# EAGLE design RingCenter_v2 (EAGLE 8.6.0)
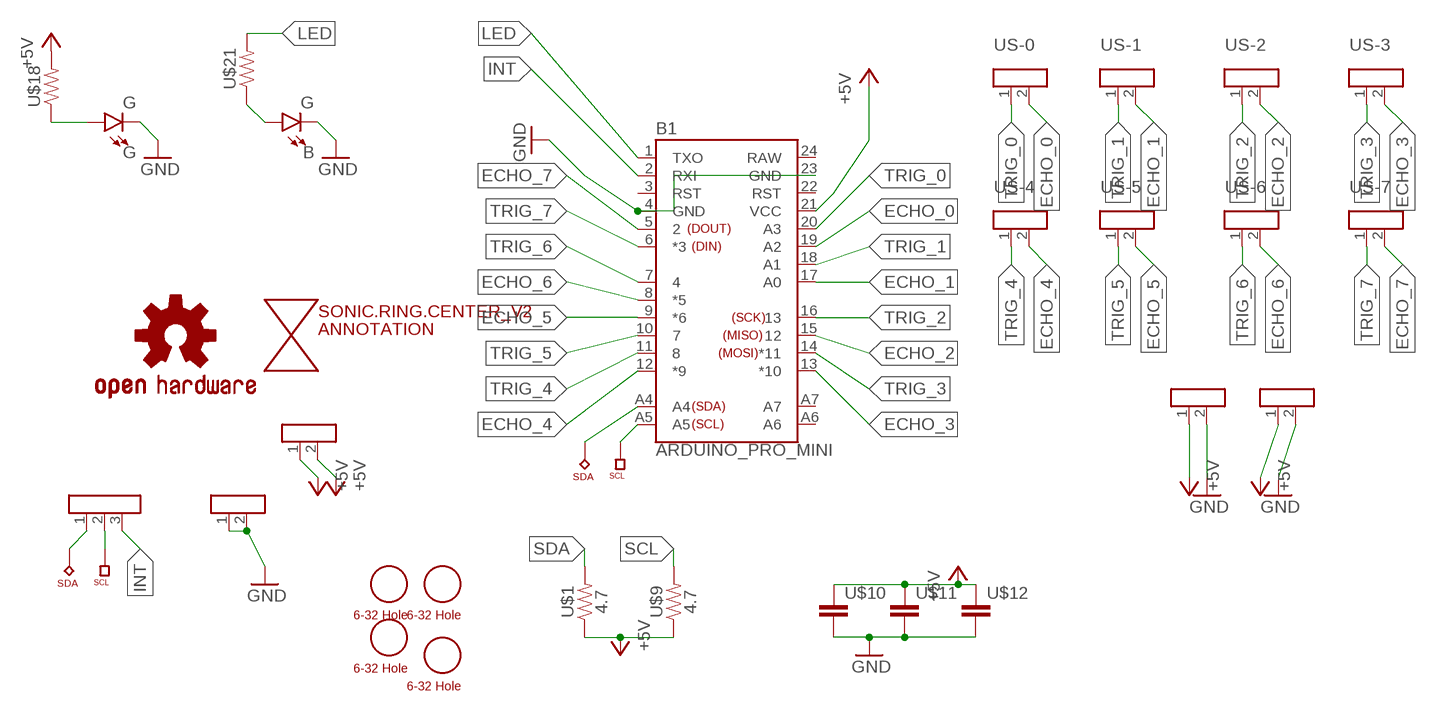
[diagram p0: schematic, sheet 1]

## Parts
B  G  LEDSMD  [LED_SMD]
B1  ARDUINO_PRO_MINI  [ARDUINO_PRO_MINI]
G  G  LEDSMD  [LED_SMD]
LOGO1  OSHW-LOGOM  [OSHW-LOGO-M]
SONIC.RING.CENTER_V2  ANNOTATION  [ANNOTATION]
U$1  4.7  RESISTORSMD  [R1206]
U$2  2XHEADER  [2XHEADER]
U$3  2XHEADER  [2XHEADER]
U$4  2XHEADER  [2XHEADER]
U$5  2XHEADER  [2XHEADER]
U$6  2XHEADER  [2XHEADER]
U$7  2XHEADER  [2XHEADER]
U$8  2XHEADER  [2XHEADER]
U$9  4.7  RESISTORSMD  [R1206]
U$10  CAP_SMCAP  [C1206]
U$11  CAP_SMCAP  [C1206]
U$12  CAP_SMCAP  [C1206]
U$13  632  [632]
U$14  632  [632]
U$15  632  [632]
U$16  632  [632]
U$17  3XHEADER  [3XHEADER]
U$18  RESISTORSMD  [R1206]
U$21  RESISTORSMD  [R1206]
US-0  2XHEADER  [2XHEADER]
US-1  2XHEADER  [2XHEADER]
US-4  2XHEADER  [2XHEADER]
US-5  2XHEADER  [2XHEADER]
US-6  2XHEADER  [2XHEADER]

## Nets
+5V [pow]: B1.21(VCC) U$1.1 U$9.1 U$10.1 U$11.1 U$12.1 U$18.2 US-4.1 US-5.1 US-6.1 US-6.2
ECHO_0: B1.19(A2) US-0.2
ECHO_1: B1.17(A0) U$8.2
ECHO_2: B1.15 U$2.2
ECHO_3: B1.13(*10) U$7.2
ECHO_4: B1.12(*9) U$3.2
ECHO_5: B1.9(*6) U$6.2
ECHO_6: B1.8(*5) U$4.2
ECHO_7: B1.5 U$5.2
GND [pow]: B1.4(GND) B1.23(GND) B.C G.C U$10.2 U$11.2 U$12.2 US-1.1 US-1.2 US-4.2 US-5.2
INT: B1.2(RXI) U$17.3
LED: B1.1(TXO) U$21.2
N$1: G.A U$18.1
N$2: B.A U$21.1
SCL: B1.A5 U$9.2 U$17.2
SDA: B1.A4 U$1.2 U$17.1
TRIG_0: B1.20(A3) US-0.1
TRIG_1: B1.18(A1) U$8.1
TRIG_2: B1.16 U$2.1
TRIG_3: B1.14(*11) U$7.1
TRIG_4: B1.11 U$3.1
TRIG_5: B1.10 U$6.1
TRIG_6: B1.7 U$4.1
TRIG_7: B1.6(*3) U$5.1
Unconnected: B1.3(RST) B1.22(RST) B1.A6 B1.A7

## Notes on the sheet
- US-0 | US-1 | US-2 | US-3
- US-4 | US-5 | US-6 | US-7

## Power pins joined to a net without a drawn wire
RAW: B1.24(RAW)

## Library data of the parts
B G = Richard_Components:LED
B1 = Richard_Micros:ARDUINO_PRO_MINI: SparkFun Pro Mini Pro Mini compatible footprint. Dimensions: 0.7 x 1.3" PCB Thickness: 0.8mm SparkFun Products: 3.3V/8MHz <https://www.sparkfun.com/products/11114> 5V/16MHz <https://www.sparkfun.com/products/11113>
LOGO1 = Richard_Symbols:OSHW-LOGO: Open-Source Hardware (OSHW) Logo This logo indicates the piece of hardware it is found on incorporates a OSHW license and/or adheres to the definition of open source hardware found here: http://freedomdefined.org/OSHW
SONIC.RING.CENTER_V2 = Richard_Symbols:ANNOTATION
U$1 U$9 U$18 U$21 = Richard_Components:RESISTOR
U$2-U$8 US-0 US-1 US-4-US-6 = Richard_Headers:2XHEADER
U$10-U$12 = Richard_Components:CAP_SM
U$13-U$16 = Richard_Holes:632
U$17 = Richard_Headers:3XHEADER

## Net classes
0 default: width 0.254 mm
1 pow: width 0.381 mm

## Board
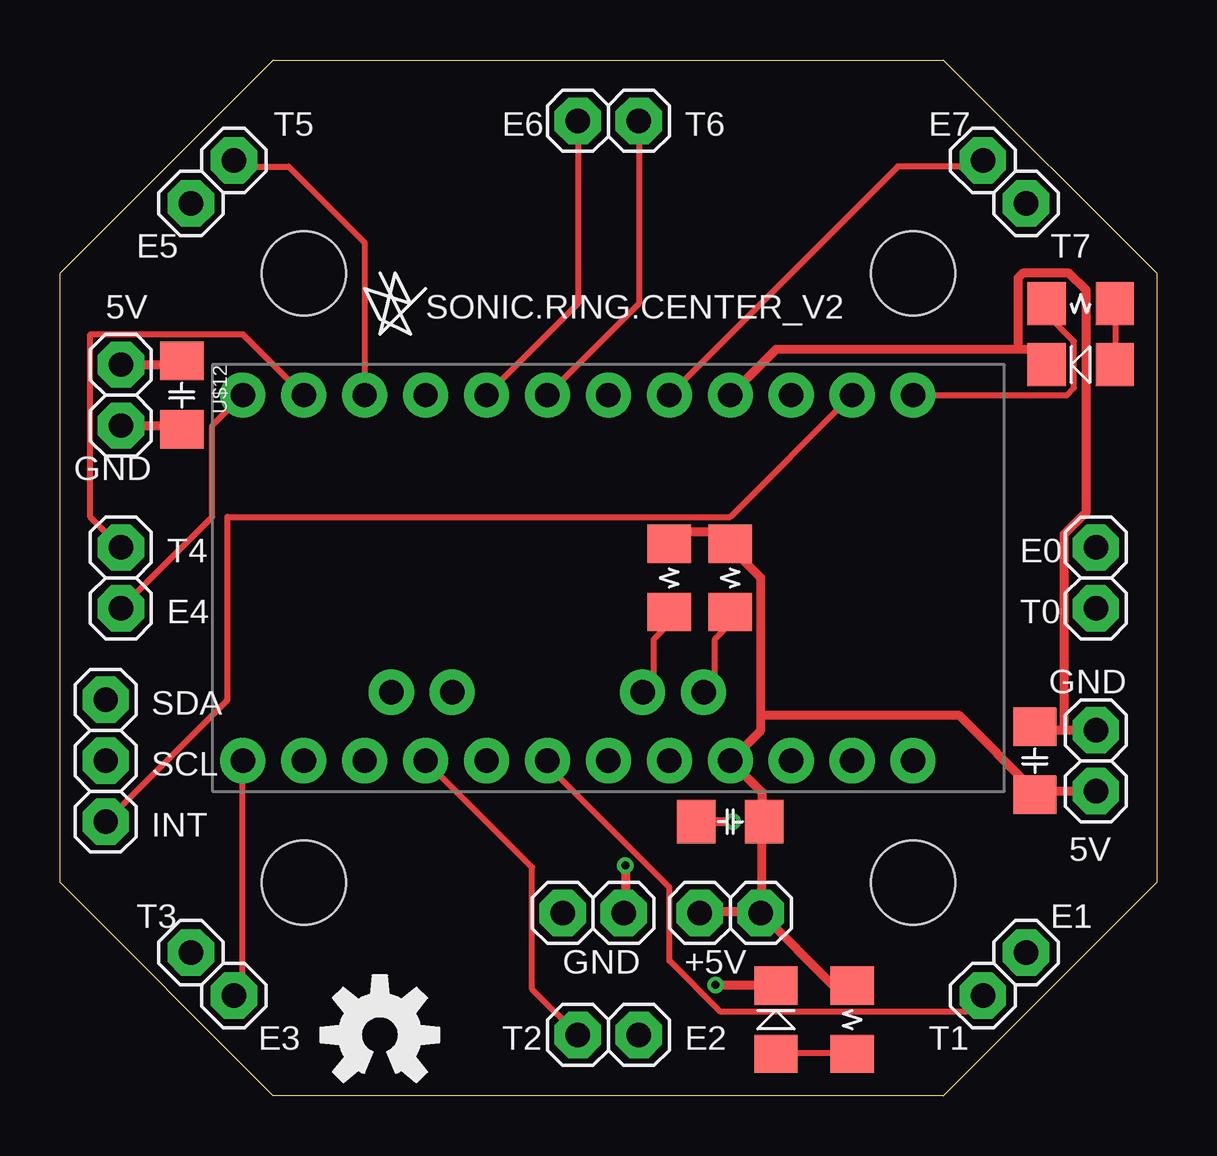
[diagram p1: board, top side]
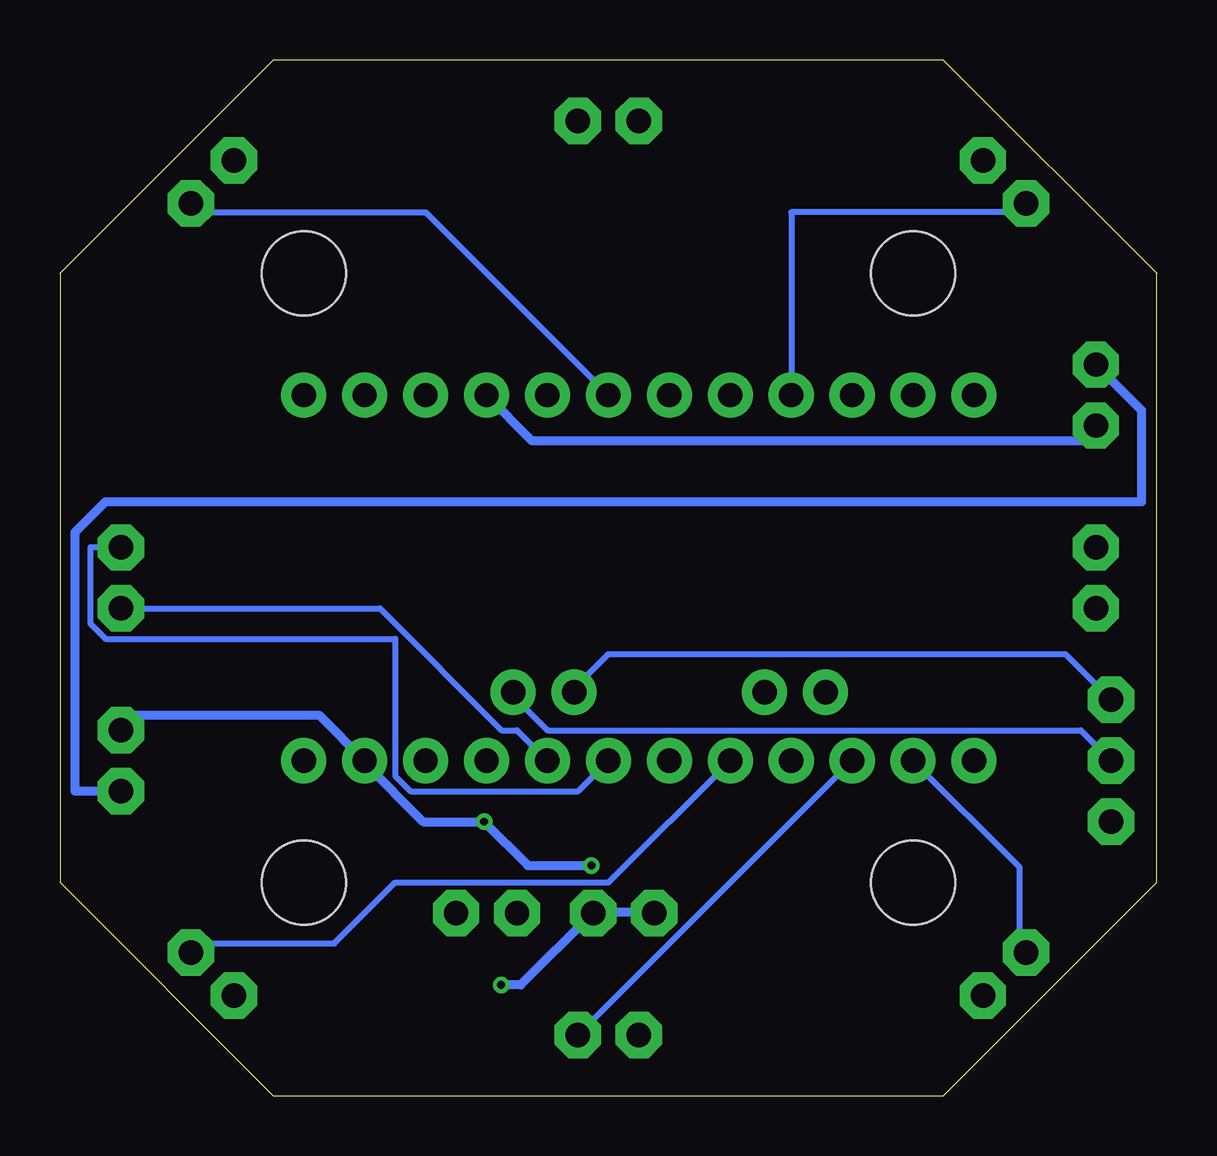
[diagram p2: board, bottom side, seen from below]

Size 45.72 x 43.18 mm. Coordinates in mm from the lower left corner, seen from the top.
Outline: 8.89,43.18 36.83,43.18 45.72,34.29 45.72,8.89 36.83,0 8.89,0 0,8.89 0,34.29 8.89,43.18
Copper layers (1*16): Top 0.0356mm / dielectric 1.5011mm / Bottom 0.0356mm
Design rules "LaenPCBOrder": minimum track width 6mil, minimum drill 13mil, track to track 6mil, track to pad 6mil, pad to pad 6mil, via to via 6mil, smd to smd 6mil, copper to edge 15mil, drill to drill 6mil, minimum pad ring 7mil, minimum via ring 7mil, stop-mask expansion 3mil, vias tented up to drill 0mil, thermal gap 10mil

### Footprints (pad centres in the part's own frame; a part is rotated, then mirrored left to right if it is on the bottom)
LED_SMD = smd 1.6 x 1.803: A -1.422,0; C 1.422,0
ARDUINO_PRO_MINI = drill 1.016 pad 1.88: 1 -7.62,12.7; 2 -7.62,10.16; 3 -7.62,7.62; 4 -7.62,5.08; 5 -7.62,2.54; 6 -7.62,0; 7 -7.62,-2.54; 8 -7.62,-5.08; 9 -7.62,-7.62; 10 -7.62,-10.16; 11 -7.62,-12.7; 12 -7.62,-15.24; 13 7.62,-15.24; 14 7.62,-12.7; 15 7.62,-10.16; 16 7.62,-7.62; 17 7.62,-5.08; 18 7.62,-2.54; 19 7.62,0; 20 7.62,2.54; 21 7.62,5.08; 22 7.62,7.62; 23 7.62,10.16; 24 7.62,12.7; A4 4.763,1.429; A5 4.763,3.969; A6 4.763,-9.049; A7 4.763,-6.509
R1206 = smd 1.6 x 1.803: 1 -1.422,0; 2 1.422,0
2XHEADER = drill 1.016 pad 1.93 octagon: 1 0,1.27; 2 0,-1.27
C1206 = smd 1.6 x 1.803: 1 -1.422,0; 2 1.422,0
632 = hole 3.5: 0,0
3XHEADER = drill 1.016 pad 1.93 octagon: 1 0,2.54; 2 0,0; 3 0,-2.54

### Placement (x,y rotation side)
B  42.54,30.48 180 top
B1  22.86,21.59 270 top
G  29.84,3.17 90 top
LOGO1  13.33,2.54 0 top
SONIC.RING.CENTER_V2  13.97,33.02 0 top
U$1  25.4,21.59 270 top
U$2  22.86,2.54 90 top
U$3  2.54,21.59 0 top
U$4  22.86,40.64 270 top
U$5  39.37,38.1 225 top
U$6  6.35,38.1 315 top
U$7  6.35,5.08 45 top
U$8  39.37,5.08 135 top
U$9  27.94,21.59 270 top
U$10  27.94,11.43 180 top
U$11  40.64,13.97 90 top
U$12  5.08,29.21 270 top
U$13  10.16,34.29 0 top
U$14  35.56,34.29 0 top
U$15  10.16,8.89 0 top
U$16  35.56,8.89 0 top
U$17  1.9,13.97 0 top
U$18  33.02,3.17 90 top
U$21  42.54,33.02 180 top
US-0  43.18,21.59 180 top
US-1  22.23,7.62 270 top
US-4  2.54,29.21 0 top
US-5  43.18,13.97 180 top
US-6  27.94,7.62 90 top

### Tracks (layer width: path | path; a pad name or v marks a point on that pad's centre or on a via)
+5V
  Top 0.381: US-4.1 5.08,30.48 U$12.1 | US-5.1 40.64,12.7 | U$1.1 25.4,23.5 27.94,23.5 U$9.1 27.94,22.86 29.21,21.59 29.21,15.87 | 29.21,15.87 29.21,15.24 B1.21 29.26,12.65 29.26,11.43 U$10.1 29.26,11.33 29.26,7.77 US-6.2 | 40.64,12.7 37.46,15.87 29.21,15.87 | 40.64,12.7 U$11.1 | US-6.2 32.21,4.62 33.02,4.62 U$18.2 | US-6.1 26.72,7.67 29.06,7.67 US-6.2
  Bottom 0.381: US-4.1 0.63,28.57 0.63,24.76 43.81,24.76 45.09,23.5 45.09,12.7 US-5.1
ECHO_0
  Bottom 0.254: B1.19 24.13,12.7 31.11,12.7 31.75,13.33 31.75,19.05 43.81,19.05 44.45,19.68 44.45,22.86 US-0.2
ECHO_1
  Bottom 0.254: B1.17 22.86,8.89 31.75,8.89 34.29,6.35 40,6.35 U$8.2
ECHO_2
  Bottom 0.254: U$2.2 B1.15
ECHO_3
  Top 0.254: B1.13 7.62,4.44 U$7.2
ECHO_4
  Top 0.254: B1.12 6.35,27.94 6.35,24.13 U$3.2
ECHO_5
  Bottom 0.254: B1.9 15.24,36.83 5.71,36.83 U$6.2
ECHO_6
  Top 0.254: B1.8 21.59,33.02 U$4.2
ECHO_7
  Top 0.254: B1.5 34.92,38.73 38.1,38.73 U$5.2
GND  (via drill 0.33)
  Top 0.381: US-4.2 5.08,27.94 U$12.2 | US-5.2 41.86,15.24 | 41.86,15.24 40.64,15.24 U$11.2 | B1.4 29.84,31.11 39.93,31.11 | 39.93,31.11 40.64,31.11 40.64,30.94 41.05,30.53 B.C | v27.33,4.62 29.77,4.62 G.C | v28.04,11.43 U$10.2 | 39.93,31.11 39.93,34.09 40.13,34.29 42.06,34.29 42.77,33.58 42.77,24.33 41.86,23.42 41.86,15.24 | v23.57,9.6 23.57,7.67 US-1.1
  Bottom 0.381: B1.4 26.03,27.3 3.17,27.3 US-4.2 | US-5.2 42.54,15.87 34.92,15.87 B1.23 33.02,13.87 30.58,11.43 v28.04,11.43 26.21,9.6 v23.57,9.6 | v27.33,4.62 26.52,4.62 23.57,7.57 US-1.1 23.37,7.67 21.03,7.67 US-1.2
INT
  Top 0.254: B1.2 27.94,24.13 6.99,24.13 6.99,16.51 U$17.3
LED
  Top 0.254: B1.1 41.96,29.21 42.27,29.51 42.27,31.44 41.15,32.56 41.15,32.97 U$21.2
N$1
  Top 0.254: G.A 29.87,1.78 33.02,1.78 U$18.1
N$2
  Top 0.254: B.A 43.99,30.53 43.99,32.97 U$21.1
SCL
  Top 0.254: U$9.2 27.94,19.68 27.3,19.05 27.3,17.14 B1.A5
  Bottom 0.254: U$17.2 3.17,15.24 25.4,15.24 26.67,16.51 B1.A5
SDA
  Top 0.254: U$1.2 25.4,19.68 24.77,19.05 24.77,17.14 B1.A4
  Bottom 0.254: U$17.1 3.81,18.41 22.86,18.41 24.13,17.14 B1.A4
TRIG_0
  Bottom 0.254: B1.20 26.67,15.24 27.3,15.24 32.38,20.32 US-0.1
TRIG_1
  Top 0.254: B1.18 20.32,13.77 25.4,8.69 25.4,5.64 27.53,3.5 37.79,3.5 U$8.1
TRIG_2
  Top 0.254: B1.16 19.68,9.52 19.68,4.44 U$2.1
TRIG_3
  Bottom 0.254: B1.14 5.71,9.52 5.71,6.35 U$7.1
TRIG_4
  Top 0.254: B1.11 7.62,31.75 1.27,31.75 1.27,24.13 U$3.1
TRIG_5
  Top 0.254: B1.10 12.7,35.56 9.53,38.73 7.62,38.73 U$6.1
TRIG_6
  Top 0.254: B1.7 24.13,33.02 U$4.1
TRIG_7
  Bottom 0.254: B1.6 30.48,36.83 40,36.83 U$5.1

### Text on the board
tPlace: T5 | E6 | T6 | E7 | E5 | T7 | 5V | GND | T4 | E0 | E4 | T0 | GND | SDA | SCL | INT | 5V | T3 | E1 | GND | +5V | E3 | T2 | E2 | T1